# Altium project RFID_CC1101_433MHz.PrjPcb
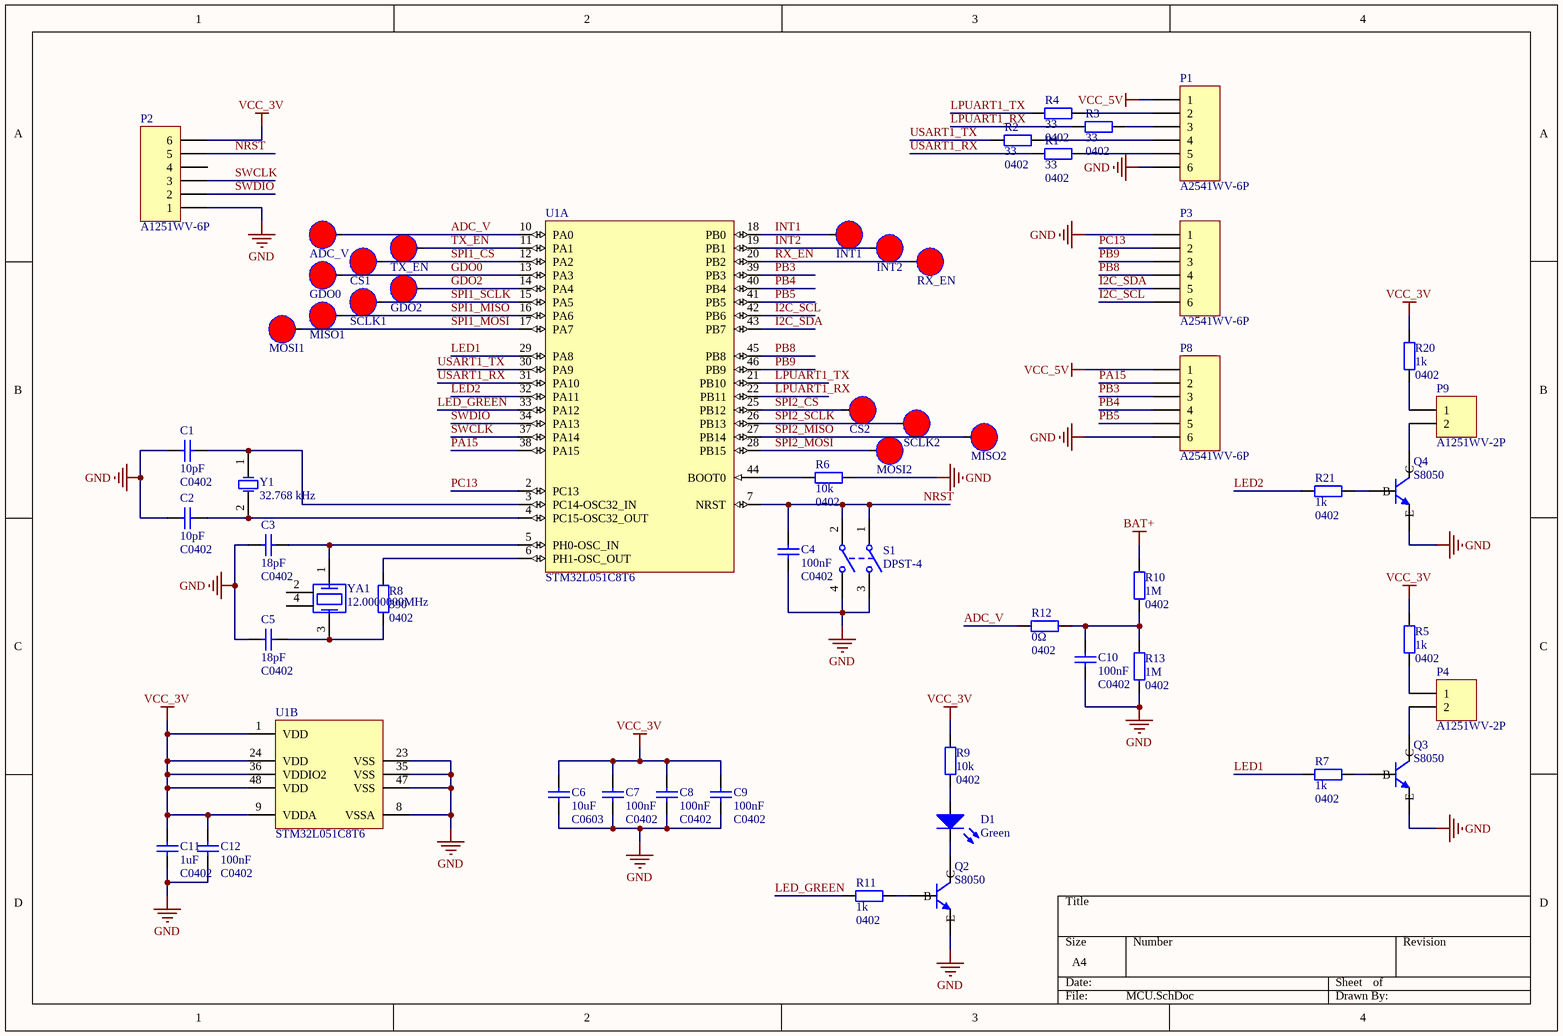
[diagram p0: MCU.SchDoc]
3 sheets, 104 parts. Net scope: global (net labels, ports and power ports of the same name join across sheets).
Board file: RFID_CC1101_433MHz.PcbDoc
Sheets:
  MCU.SchDoc
  MEMS&RF.SchDoc
  Power.SchDoc

## Sheet MCU.SchDoc
size A4

### Parts
(Parts that share a designator on the sheet are numbered #1, #2 ... from top to bottom, then left to right.)
ADC_V  TP-EMB-SMT-Single-20mil-1pin  [EMB-SMT-40MILX40MIL]  (value not drawn)
C1#1  10pF  PackageReference: C0402  [0402]
C2#1  10pF  PackageReference: C0402  [0402]
C3#1  18pF  PackageReference: C0402  [0402]
C4#1  100nF  PackageReference: C0402  [0402]
C5#1  18pF  PackageReference: C0402  [0402]
C6#1  10uF  PackageReference: C0603  [1608[0603]]
C7#1  100nF  PackageReference: C0402  [0402]
C8  100nF  PackageReference: C0402  [0402]
C9  100nF  PackageReference: C0402  [0402]
C10  100nF  PackageReference: C0402  [0402]
C11  1uF  PackageReference: C0402  [0402]
C12  100nF  PackageReference: C0402  [0402]
CS1  TP-EMB-SMT-Single-20mil-1pin  [EMB-SMT-40MILX40MIL]  (value not drawn)
CS2  TP-EMB-SMT-Single-20mil-1pin  [EMB-SMT-40MILX40MIL]  (value not drawn)
D1#1  Green  [0603/K]
GDO0  TP-EMB-SMT-Single-20mil-1pin  [EMB-SMT-40MILX40MIL]  (value not drawn)
GDO2  TP-EMB-SMT-Single-20mil-1pin  [EMB-SMT-40MILX40MIL]  (value not drawn)
INT1  TP-EMB-SMT-Single-20mil-1pin  [EMB-SMT-40MILX40MIL]  (value not drawn)
INT2  TP-EMB-SMT-Single-20mil-1pin  [EMB-SMT-40MILX40MIL]  (value not drawn)
MISO1  TP-EMB-SMT-Single-20mil-1pin  [EMB-SMT-40MILX40MIL]  (value not drawn)
MISO2  TP-EMB-SMT-Single-20mil-1pin  [EMB-SMT-40MILX40MIL]  (value not drawn)
MOSI1  TP-EMB-SMT-Single-20mil-1pin  [EMB-SMT-40MILX40MIL]  (value not drawn)
MOSI2  TP-EMB-SMT-Single-20mil-1pin  [EMB-SMT-40MILX40MIL]  (value not drawn)
P1  A2541WV-6P  [A2541WV-6P]
P2#1  A1251WV-6P  [A1251WV-6P-SWD]
P3#1  A2541WV-6P  [A2541WV-6P]
P4#1  A1251WV-2P  [A1251WV-2P]
P8  A2541WV-6P  [A2541WV-6P]
P9  A1251WV-2P  [A1251WV-2P]
Q2  S8050  [SOT-23B_N]
Q3  S8050  [SOT-23B_N]
Q4  S8050  [SOT-23B_N]
R1#1  33  PackageReference: 0402  [RESC1005X04N]
R2#1  33  PackageReference: 0402  [RESC1005X04N]
R3#1  33  PackageReference: 0402  [RESC1005X04N]
R4#1  33  PackageReference: 0402  [RESC1005X04N]
R5  1k  PackageReference: 0402  [RESC1005X04N]
R6  10k  PackageReference: 0402  [RESC1005X04N]
R7  1k  PackageReference: 0402  [RESC1005X04N]
R8  390  PackageReference: 0402  [RESC1005X04N]
R9  10k  PackageReference: 0402  [RESC1005X04N]
R10  1M  PackageReference: 0402  [RESC1005X04N]
R11  1k  PackageReference: 0402  [RESC1005X04N]
R12  0Ω  PackageReference: 0402  [RESC1005X04N]
R13  1M  PackageReference: 0402  [RESC1005X04N]
R20  1k  PackageReference: 0402  [RESC1005X04N]
R21  1k  PackageReference: 0402  [RESC1005X04N]
RX_EN  TP-EMB-SMT-Single-20mil-1pin  [EMB-SMT-40MILX40MIL]  (value not drawn)
S1  DPST-4  [DPST]
SCLK1  TP-EMB-SMT-Single-20mil-1pin  [EMB-SMT-40MILX40MIL]  (value not drawn)
SCLK2  TP-EMB-SMT-Single-20mil-1pin  [EMB-SMT-40MILX40MIL]  (value not drawn)
TX_EN  TP-EMB-SMT-Single-20mil-1pin  [EMB-SMT-40MILX40MIL]  (value not drawn)
U1  STM32L051C8T6  [STM-LQFP48_N]  (parts A,B of 2)
Y1  32.768 kHz  [XTAL-2012]
YA1#1  12.0000000MHz  [XTAL-SMT-4P]

### Nets
BAT+: R10.2
GND: C1#1.1 C2#1.1 C3#1.1 C4#1.1 C5#1.1 C6#1.1 C7#1.1 C8.1 C9.1 C10.1 C11.1 C12.1 P1.6 P2#1.1 P3#1.1 P8.6 Q2.E Q3.E Q4.E R6.2 R13.1 S1.3(NO1) S1.4(NO2) U1.8(VSSA) U1.23(VSS) U1.35(VSS) U1.47(VSS)
VCC_3V: C6#1.2 C7#1.2 C8.2 C9.2 C11.2 C12.2 P2#1.6 R5.2 R9.2 R20.2 U1.1(VDD) U1.9(VDDA) U1.24(VDD) U1.36(VDDIO2) U1.48(VDD)
VCC_5V: P1.1 P8.1
ADC_V: ADC_V.1 R12.1 U1.10(PA0)
GDO0: GDO0.1 U1.13(PA3)
GDO2: GDO2.1 U1.14(PA4)
I2C_SCL: P3#1.6 U1.42(PB6)
I2C_SDA: P3#1.5 U1.43(PB7)
INT1: INT1.1 U1.18(PB0)
INT2: INT2.1 U1.19(PB1)
LED1: R7.1 U1.29(PA8)
LED2: R21.1 U1.32(PA11)
LED_GREEN: R11.1 U1.33(PA12)
LPUART1_RX: R3#1.1 U1.22(PB11)
LPUART1_TX: R4#1.1 U1.21(PB10)
NRST: C4#1.2 P2#1.5 S1.1(COMMON1) S1.2(COMMON2) U1.7(NRST)
PA15: P8.2 U1.38(PA15)
PB3: P8.3 U1.39(PB3)
PB4: P8.4 U1.40(PB4)
PB5: P8.5 U1.41(PB5)
PB8: P3#1.4 U1.45(PB8)
PB9: P3#1.3 U1.46(PB9)
PC13: P3#1.2 U1.2(PC13)
RX_EN: RX_EN.1 U1.20(PB2)
SPI1_CS: CS1.1 U1.12(PA2)
SPI1_MISO: MISO1.1 U1.16(PA6)
SPI1_MOSI: MOSI1.1 U1.17(PA7)
SPI1_SCLK: SCLK1.1 U1.15(PA5)
SPI2_CS: CS2.1 U1.25(PB12)
SPI2_MISO: MISO2.1 U1.27(PB14)
SPI2_MOSI: MOSI2.1 U1.28(PB15)
SPI2_SCLK: SCLK2.1 U1.26(PB13)
SWCLK: P2#1.3 U1.37(PA14)
SWDIO: P2#1.2 U1.34(PA13)
TX_EN: TX_EN.1 U1.11(PA1)
USART1_RX: R1#1.1 U1.31(PA10)
USART1_TX: R2#1.2 U1.30(PA9)
NetC1#1_2: C1#1.2 U1.3(PC14-OSC32_IN) Y1.1(OSC1)
NetC2#1_2: C2#1.2 U1.4(PC15-OSC32_OUT) Y1.2(OSC2)
NetC3#1_2: C3#1.2 U1.5(PH0-OSC_IN) YA1#1.1
NetC5#1_2: C5#1.2 R8.1 YA1#1.3
NetC10_2: C10.2 R10.1 R12.2 R13.2
NetD1#1_A: D1#1.A R9.1
NetD1#1_K: D1#1.K Q2.C
NetP1_2: P1.2 R4#1.2
NetP1_3: P1.3 R3#1.2
NetP1_4: P1.4 R2#1.1
NetP1_5: P1.5 R1#1.2
NetP4#1_1: P4#1.1 R5.1
NetP4#1_2: P4#1.2 Q3.C
NetP9_1: P9.1 R20.1
NetP9_2: P9.2 Q4.C
NetQ2_B: Q2.B R11.2
NetQ3_B: Q3.B R7.2
NetQ4_B: Q4.B R21.2
NetR6_1: R6.1 U1.44(BOOT0)
NetR8_2: R8.2 U1.6(PH1-OSC_OUT)

Not connected (* = marked no-connect by the designer): P2#1 4; YA1#1 2 4

### Library data of the parts
ADC_V CS1 CS2 GDO0 GDO2 INT1 INT2 MISO1 MISO2 MOSI1 MOSI2 RX_EN SCLK1 SCLK2 TX_EN = TP-EMB-SMT-Single-20mil-1pin: Test Point Designed for holding a standard probe lead
C1#1 C2#1 = CC0402FRNPO9BN100: Capacitor (0402,NPO,10pF,DC 50V,±1%) YAGEO; Published: 8-Jun-2000; LatestRevisionDate: 29-May-2009; LatestRevisionNote: IPC-7351 Footprint Added.; Publisher: Altium Limited; PackageDescription: Chip Capacitor; Value: 10pF
C3#1 C5#1 = CC0402FRNPO9BN180: Capacitor (0402,NPO,18pF,DC 50V,±1%) YAGEO; Published: 8-Jun-2000; LatestRevisionDate: 29-May-2009; LatestRevisionNote: IPC-7351 Footprint Added.; Publisher: Altium Limited; PackageDescription: Chip Capacitor; Value: 18pF
C4#1 C7#1 C8-C10 C12 = GRM155R71H104KE14: Capacitor (0402,X7R,100nF,DC 50V,±10%) Murata; Published: 8-Jun-2000; LatestRevisionDate: 29-May-2009; LatestRevisionNote: IPC-7351 Footprint Added.; Publisher: Altium Limited; PackageDescription: Chip Capacitor; Value: 100nF
C6#1 = GRM188R61E106MA73: Capacitor(0603,X5R(EIA),10uF,DC 25V,+/-20 %) muRata; Published: 8-Jun-2000; LatestRevisionDate: 29-May-2009; LatestRevisionNote: IPC-7351 Footprint Added.; Publisher: Altium Limited; PackageDescription: Chip Capacitor; Value: 10uF
C11 = GRM155R61E105KE11: Capacitor (0402,X5R,1uF,DC 25V,±10%) Murata; Published: 8-Jun-2000; LatestRevisionDate: 29-May-2009; LatestRevisionNote: IPC-7351 Footprint Added.; Publisher: Altium Limited; PackageDescription: Chip Capacitor; Value: 1uF
D1#1 = XL-1608SYGC: Standard 0603 SMD LED, Green, 1.6-2.2V; Published: 8-Jun-2000; LatestRevisionDate: 17-Jul-2002; LatestRevisionNote: Re-released for DXP Platform.; PackageVersion: Feb-2002; PackageReference: 0603; Publisher: Altium Limited; PackageDescription: SM LED; 2 Flat Leads; Valid: Green
P1 P3#1 P8 = A2541WV-6P: Header, 6-Pin, 针座-2.54mm间距，180度，DIP排针; LatestRevisionDate: 17-Jul-2002; LatestRevisionNote: Re-released for DXP Platform.; Publisher: Altium Limited
P2#1 = A1251WV-6P: Header, 6-Pin, 1.25mm PITCH, 180° WAFER; LatestRevisionDate: 17-Jul-2002; LatestRevisionNote: Re-released for DXP Platform.; Publisher: Altium Limited
P4#1 P9 = A1251WV-2P: Header, 2-Pin, 1.25mm PITCH, 180° WAFER; LatestRevisionDate: 17-Jul-2002; LatestRevisionNote: Re-released for DXP Platform.; Publisher: Altium Limited
Q2-Q4 = S8050: NPN General Purpose Amplifier, -55 to +150°C; Manufacturer: 扬州扬杰电子科技股份有限公司; VCBO(V): 40; VCEO(V): 25; VEBO(V): 5; IC(mA): 500; PC(mW): 300; Package: SOT-23
R1#1 R2#1 R3#1 R4#1 = RC0402FR-0733RL: Resistor 0402(1005) 33Ω ±1%; PackageDescription: Chip Resistor, 2-Leads, Body 1.00x0.50mm, IPC Medium Density; Value: 33
R5 R7 R11 R20 R21 = RC0402FR-071KL: Resistor 0402(1005) 1kΩ ±1%; PackageDescription: Chip Resistor, 2-Leads, Body 1.00x0.50mm, IPC Medium Density; Value: 1k
R6 R9 = RC0402FR-0710KL: Resistor 0402(1005) 10kΩ ±1%; PackageDescription: Chip Resistor, 2-Leads, Body 1.00x0.50mm, IPC Medium Density; Value: 10k
R8 = RC0402FR-07390RL: Resistor 0402(1005) 390Ω ±1%; PackageDescription: Chip Resistor, 2-Leads, Body 1.00x0.50mm, IPC Medium Density; Value: 390
R10 R13 = RC0402FR-071ML: Resistor 0402(1005) 1MΩ ±1%; PackageDescription: Chip Resistor, 2-Leads, Body 1.00x0.50mm, IPC Medium Density; Value: 1M
R12 = RC0402JR: Resistor 0402(1005) 0Ω; PackageDescription: Chip Resistor, 2-Leads, Body 1.00x0.50mm, IPC Medium Density; Value: 0Ω
S1 = CX-G001: 5.2*5.2轻触开关; Published: 24-Mar-1999; LatestRevisionDate: 17-Jul-2002; LatestRevisionNote: Re-released for DXP Platform.; PackageReference: DPST-4; Publisher: Altium Limited; PackageDescription: Switch; 4 Leads
U1 = STM32L051C8T6: Access line ultra-low-power 32-bit MCU Arm®-based Cortex®-M0+, 64 KB Flash, 8 KB SRAM,2 KB EEPROM, 38 fast I/Os, 48-pin LQFP, -40 to 125 degC, Tray; A/D Converter: 2x12-bit; Core: ARM Cortex-M0+; FLASH Size (Prog) (kB): 64; I/Os (High Current): 37; Internal RAM Size (kB): 20; Operating Frequency(F) (Processor speed) (MHz): 32; Supply Voltage(Vcc) min (V): 2; DatasheetVersion: Rev. 16; PackageVersion: Rev. 6, 06/2013; PackageReference: LQFP48; PackageDescription: 48-Pin Low Profile Quad Flat Package, 7 x 7 mm Body, 0.5 mm Pitch; Supplier 1: Digi-Key; Supplier Part Number 1: 497-11517-ND; Supplier 2: Farnell; Supplier Part Number 2: 1899017; Supplier 3: Newark; Supplier Part Number 3: 72T2644; Supplier 4: Mouser; Supplier Part Number 4: 511-STM32L051C8T6; Packing: Tray; Mounting Technology: Surface Mount; PartNumber: STM32L051C8T6; ComponentLink1Description: Manufacturer URL; ComponentLink1URL: http://www.st.com/web/en/home.html; ComponentLink2Description: Datasheet; ComponentLink2URL: http://www.st.com/st-web-ui/static/active/en/resource/technical/document/datasheet/CD00161566.pdf; ComponentLink3Description: Package Specification; ComponentLink3URL: http://www.st.com/st-web-ui/static/active/en/resource/technical/document/datasheet/DM00058181.pdf
Y1 = 7RC32768F12UC: Crystal Oscillator, 2.0×1.2×0.6 mm, 2 Pins, 32.768kHz, -40°C~+85°C, 12pF; Manufacturer: SJK; Package size (L×W×H): 2.0×1.2×0.60 mm; Frequency Tolerance: ±5ppm, ±10ppm, ±20ppm (max.) at 25°C; Frequency range: 32.768 kHz; Operating Temperature Range: Re-released for DXP Platform.; PackageReference: -40°C~+85°C; Load Capacitance: 12pF
YA1#1 = 7U12000E12UCG: Crystal Oscillator, 3.2×2.5×0.70 mm, 4 Pins, 12.000MHz, -40°C~+85°C, 12pF, ±10PPM; Manufacturer: SJK; Mode: AT/Fundamental; Frequency Tolerance: ±10ppm max; Load Capacitance(CL): 12.0pF; Shunt Capacitance: 3.0 pF Max; Frequency Range: 12.0000000MHz; Operating Temperature Range: -40 °C to +85°C; Package size (L×W×H): 3.2×2.5×0.70 mm

## Sheet MEMS&RF.SchDoc
size A4
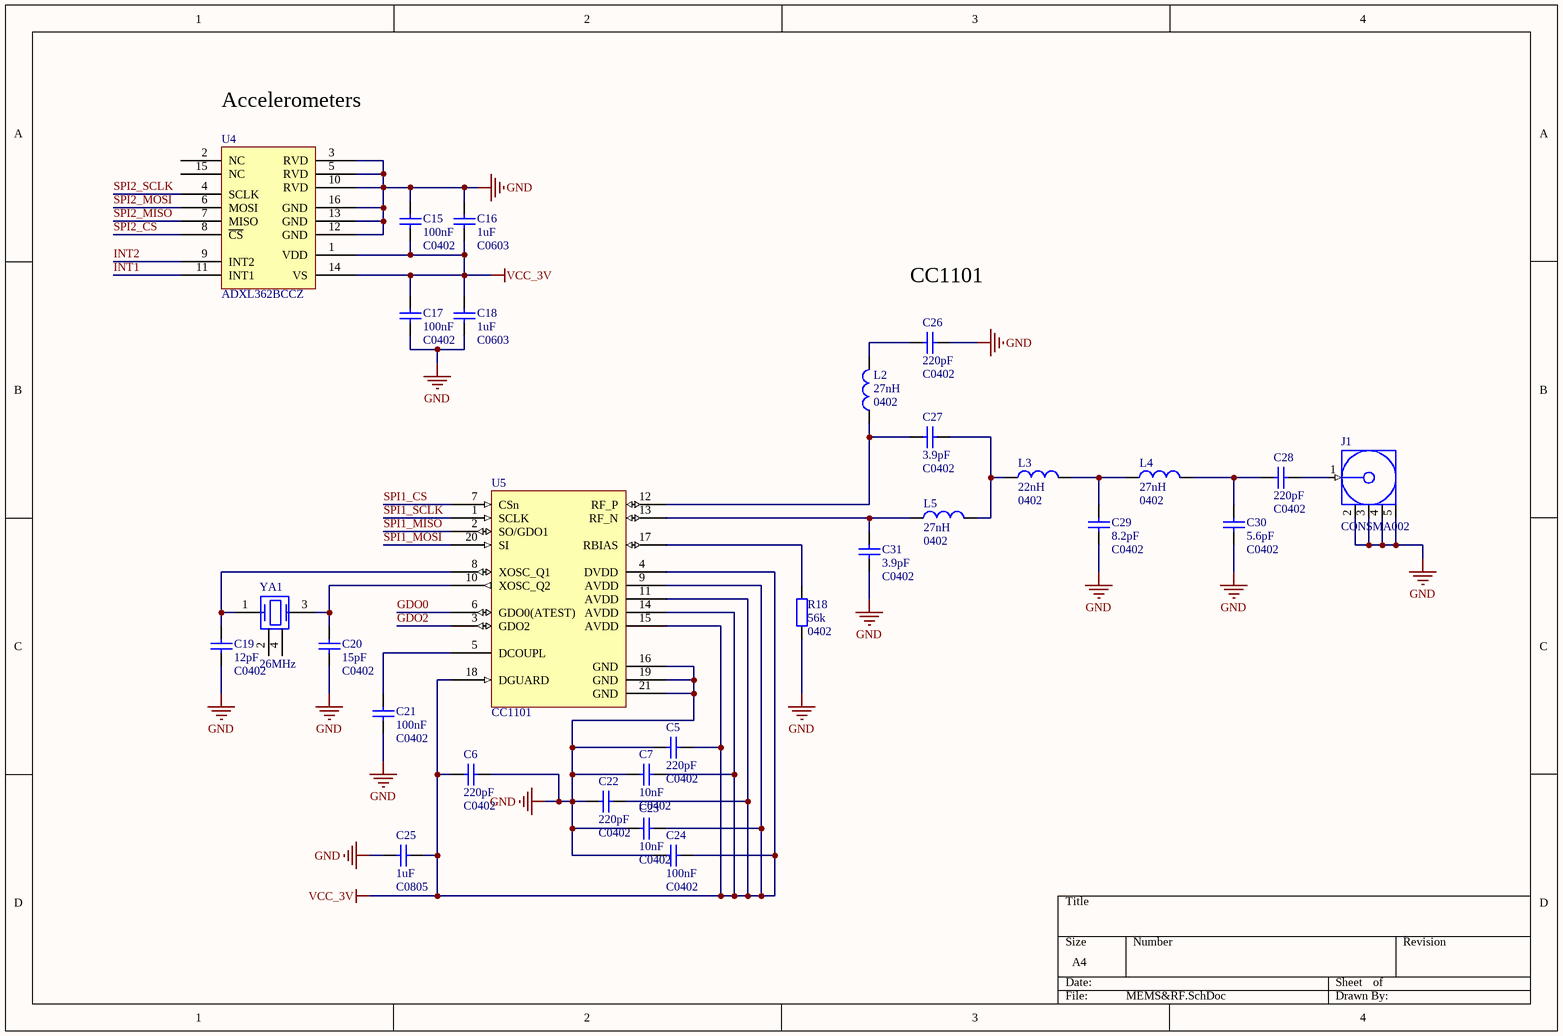
[diagram p1: MEMS&RF.SchDoc]

### Parts
(Parts that share a designator on the sheet are numbered #1, #2 ... from top to bottom, then left to right.)
C5#2  220pF  PackageReference: C0402  [0402]
C6#2  220pF  PackageReference: C0402  [0402]
C7#2  10nF  PackageReference: C0402  [0402]
C15  100nF  PackageReference: C0402  [0402]
C16  1uF  PackageReference: C0603  [1608[0603]]
C17  100nF  PackageReference: C0402  [0402]
C18  1uF  PackageReference: C0603  [1608[0603]]
C19  12pF  PackageReference: C0402  [0402]
C20  15pF  PackageReference: C0402  [0402]
C21  100nF  PackageReference: C0402  [0402]
C22  220pF  PackageReference: C0402  [0402]
C23  10nF  PackageReference: C0402  [0402]
C24  100nF  PackageReference: C0402  [0402]
C25  1uF  [C0805]
C26  220pF  PackageReference: C0402  [0402]
C27  3.9pF  PackageReference: C0402  [0402]
C28  220pF  PackageReference: C0402  [0402]
C29  8.2pF  PackageReference: C0402  [0402]
C30  5.6pF  PackageReference: C0402  [0402]
C31  3.9pF  PackageReference: C0402  [0402]
J1  CONSMA002  [CON-SMA-RA]
L2  27nH  [0402]
L3  22nH  [0402]
L4  27nH  [0402]
L5  27nH  [0402]
R18  56k  PackageReference: 0402  [RESC1005X04N]
U4  ADXL362BCCZ  [LGA_CC-16-4]
U5  CC1101  [QFN50P400X400X100_HS-21N]
YA1#2  26MHz  [XTAL-SMT-4P]

### Nets
GND: C5#2.2 C6#2.1 C7#2.1 C15.1 C16.2 C17.2 C18.1 C19.1 C20.1 C21.1 C22.2 C23.1 C24.2 C25.1 C26.2 C29.1 C30.1 C31.1 J1.2(GND) J1.3(GND) J1.4(GND) J1.5(GND) R18.1 U4.3(RVD) U4.5(RVD) U4.10(RVD) U4.12(GND) U4.13(GND) U4.16(GND) U5.16(GND) U5.19(GND) U5.21(GND)
VCC_3V: C5#2.1 C6#2.2 C7#2.2 C15.2 C16.1 C17.1 C18.2 C22.1 C23.2 C24.1 C25.2 U4.1(VDD) U4.14(VS) U5.4(DVDD) U5.9(AVDD) U5.11(AVDD) U5.14(AVDD) U5.15(AVDD) U5.18(DGUARD)
GDO0: U5.6(GDO0(ATEST))
GDO2: U5.3(GDO2)
INT1: U4.11(INT1)
INT2: U4.9(INT2)
SPI1_CS: U5.7(CSn)
SPI1_MISO: U5.2(SO/GDO1)
SPI1_MOSI: U5.20(SI)
SPI1_SCLK: U5.1(SCLK)
SPI2_CS: U4.8(~{CS})
SPI2_MISO: U4.7(MISO)
SPI2_MOSI: U4.6(MOSI)
SPI2_SCLK: U4.4(SCLK)
NetC19_2: C19.2 U5.8(XOSC_Q1) YA1#2.1
NetC20_2: C20.2 U5.10(XOSC_Q2) YA1#2.3
NetC21_2: C21.2 U5.5(DCOUPL)
NetC26_1: C26.1 L2.2
NetC27_1: C27.1 L2.1 U5.12(RF_P)
NetC27_2: C27.2 L3.1 L5.2
NetC28_1: C28.1 C30.2 L4.2
NetC28_2: C28.2 J1.1(Signal)
NetC29_2: C29.2 L3.2 L4.1
NetC31_2: C31.2 L5.1 U5.13(RF_N)
NetR18_2: R18.2 U5.17(RBIAS)

Not connected (* = marked no-connect by the designer): U4 2(NC) 15(NC); YA1#2 2 4

### Notes on the sheet
- (near U4) Accelerometers
- CC1101

### Library data of the parts
C5#2 C6#2 C22 C26 C28 = GRM1555C1H221JA01D: Capacitor (0402,NP0,220pF,DC 50V,±5%) Murata; Published: 8-Jun-2000; LatestRevisionDate: 29-May-2009; LatestRevisionNote: IPC-7351 Footprint Added.; Publisher: Altium Limited; PackageDescription: Chip Capacitor; Value: 220pF
C7#2 C23 = GRM155R71E103KA01D: Capacitor (0402,X7R,10nF,DC 25V,±10%) Murata; Published: 8-Jun-2000; LatestRevisionDate: 29-May-2009; LatestRevisionNote: IPC-7351 Footprint Added.; Publisher: Altium Limited; PackageDescription: Chip Capacitor; Value: 10nF
C15 C17 = C1005X7R1H104K050BE: Capacitor (0402,X7R,100nF,DC 50V,±10%) TDK; Published: 8-Jun-2000; LatestRevisionDate: 29-May-2009; LatestRevisionNote: IPC-7351 Footprint Added.; Publisher: Altium Limited; PackageDescription: Chip Capacitor; Value: 100nF
C16 C18 = CGA3E2X5R1A105K080AA: Capacitor (0603,X5R,1uF,DC 10V,+/-10%) TDK; Published: 8-Jun-2000; LatestRevisionDate: 29-May-2009; LatestRevisionNote: IPC-7351 Footprint Added.; Publisher: Altium Limited; PackageDescription: Chip Capacitor; Value: 1uF
C19 = GRM1555C1H120JZ01D: Capacitor (0402,NP0,12pF,DC 50V,±5%) Murata; Published: 8-Jun-2000; LatestRevisionDate: 29-May-2009; LatestRevisionNote: IPC-7351 Footprint Added.; Publisher: Altium Limited; PackageDescription: Chip Capacitor; Value: 12pF
C20 = GRM1555C1H150JZ01D: Capacitor (0402,NP0,15pF,DC 50V,±5%) Murata; Published: 8-Jun-2000; LatestRevisionDate: 29-May-2009; LatestRevisionNote: IPC-7351 Footprint Added.; Publisher: Altium Limited; PackageDescription: Chip Capacitor; Value: 15pF
C21 C24 = GRM155R71A104KA01D: Capacitor (0402,X5R,100nF,DC 10V,±10%) Murata; Published: 8-Jun-2000; LatestRevisionDate: 29-May-2009; LatestRevisionNote: IPC-7351 Footprint Added.; Publisher: Altium Limited; PackageDescription: Chip Capacitor; Value: 100nF
C25 = GRM21BR71C105KA01L: Capacitor (0805,X7R,1uF,DC 16V,±10%) Murata; Published: 8-Jun-2000; LatestRevisionDate: 29-May-2009; LatestRevisionNote: IPC-7351 Footprint Added.; Publisher: Altium Limited; PackageDescription: Chip Capacitor; Value: 1uF; PackageReference: C0805
C27 C31 = GRM1555C1H3R9CZ01D: Capacitor (0402,NP0,3.9pF,DC 50V,±0.25pF) Murata; Published: 8-Jun-2000; LatestRevisionDate: 29-May-2009; LatestRevisionNote: IPC-7351 Footprint Added.; Publisher: Altium Limited; PackageDescription: Chip Capacitor; Value: 3.9pF
C29 = GRM1555C1H8R2CZ01D: Capacitor (0402,NP0,8.2pF,DC 50V,±0.25pF) Murata; Published: 8-Jun-2000; LatestRevisionDate: 29-May-2009; LatestRevisionNote: IPC-7351 Footprint Added.; Publisher: Altium Limited; PackageDescription: Chip Capacitor; Value: 8.2pF
C30 = GRM1555C1H5R6CZ01D: Capacitor (0402,NP0,5.6pF,DC 50V,±0.25pF) Murata; Published: 8-Jun-2000; LatestRevisionDate: 29-May-2009; LatestRevisionNote: IPC-7351 Footprint Added.; Publisher: Altium Limited; PackageDescription: Chip Capacitor; Value: 5.6pF
J1 = CONSMA002: SMA Female Right Angle PCB Mount Connector; DatasheetVersion: rev1.2, Aug-2008; PackageVersion: rev1.2, Aug-2008; PackageReference: CON-SMA-RA; PackageDescription: SMA Female Right Angle, PCB Mount Connector, Thru-Hole, 7 x 7 mm Body; ComponentLink1Description: Manufacturer URL; ComponentLink1URL: http://www.linxtechnologies.com/; ComponentLink2Description: Datasheet; ComponentLink2URL: http://www.connectorcity.com/diagrams/SMA/CONSMA002.pdf
L2 L4 L5 = LQG15HS27NJ02D: Inductor, 27n, 0402, ±5% / Murata; Published: 8-Jun-2000; LatestRevisionDate: 29-May-2009; LatestRevisionNote: IPC-7351 Footprint Added.; Publisher: Altium Limited; PackageDescription: Inductor; Value: 27nH; PackageReference: 0402
L3 = LQG15HS22NJ02D: Inductor, 22n, 0402, ±5% / Murata; Published: 8-Jun-2000; LatestRevisionDate: 29-May-2009; LatestRevisionNote: IPC-7351 Footprint Added.; Publisher: Altium Limited; PackageDescription: Inductor; Value: 22nH; PackageReference: 0402
R18 = RK73H1ETTP5602F: Resistor, 56k ohms, 0402, ±1% Koa; PackageDescription: Chip Resistor, 2-Leads, Body 1.00x0.50mm, IPC Medium Density; Value: 56k
U4 = ADXL362BCCZ: ADXL362, LGA, CC-16-4.
U5 = CC1101: Low-Power Sub-1GHz RF Transceiver
YA1#2 = NX3225GA-26M: Crystal, 26.000000MHz, 10.0pF, 50 ohms max, 20/40 ppm, -40C to +85C / , NDK; Valid: 26MHz

## Sheet Power.SchDoc
size A4
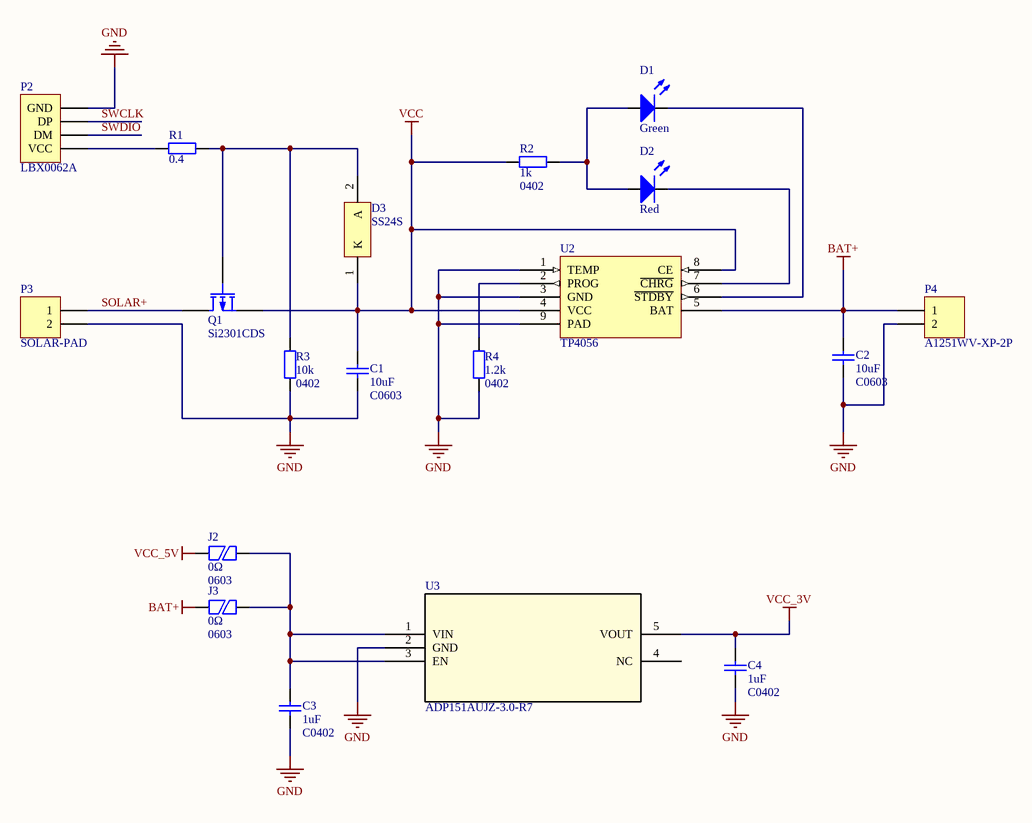
[diagram p2: Power.SchDoc]

### Parts
(Parts that share a designator on the sheet are numbered #1, #2 ... from top to bottom, then left to right.)
C1#2  10uF  PackageReference: C0603  [1608[0603]]
C2#2  10uF  PackageReference: C0603  [1608[0603]]
C3#2  1uF  PackageReference: C0402  [0402]
C4#2  1uF  PackageReference: C0402  [0402]
D1#2  Green  [0603/K]
D2  Red  [0603/K]
D3  SS24S  [ONSC-SMA-2-403D-02_V]
J2  0Ω  PackageReference: 0603  [1608[0603] - jumper]
J3  0Ω  PackageReference: 0603  [1608[0603] - jumper]
P2#2  LBX0062A  [LBX0062A]
P3#2  SOLAR-PAD  [SOLAR-PAD]
P4#2  A1251WV-XP-2P  [A1251WV-XP-2P]
Q1  Si2301CDS  [SOT95P237X112-3N]
R1#2  0.4  [RESC3216X07N]
R2#2  1k  PackageReference: 0402  [RESC1005X04N]
R3#2  10k  PackageReference: 0402  [RESC1005X04N]
R4#2  1.2k  PackageReference: 0402  [RESC1005X04N]
U2  TP4056  [ESOP-9N]
U3  ADP151AUJZ-3.0-R7  [UJ_5]

### Nets
BAT+: C2#2.2 J3.1 P4#2.1 U2.5(BAT)
GND: C1#2.1 C2#2.1 C3#2.1 C4#2.1 P2#2.4(GND) P3#2.2 P4#2.2 R3#2.1 R4#2.1 U2.1(TEMP) U2.3(GND) U2.9(PAD) U3.2(GND)
VCC: C1#2.2 D3.1(K) Q1.2(S) R2#2.1 U2.4(VCC) U2.8(CE)
VCC_3V: C4#2.2 U3.5(VOUT)
VCC_5V: J2.1
SOLAR+: P3#2.1 Q1.3(D)
SWCLK: P2#2.3(DP)
SWDIO: P2#2.2(DM)
NetC3#2_2: C3#2.2 J2.2 J3.2 U3.1(VIN) U3.3(EN)
NetD1#2_A: D1#2.A D2.A R2#2.2
NetD1#2_K: D1#2.K U2.6(~{STDBY})
NetD2_K: D2.K U2.7(~{CHRG})
NetD3_2: D3.2(A) Q1.1(G) R1#2.2 R3#2.2
NetP2#2_1: P2#2.1(VCC) R1#2.1
NetR4#2_2: R4#2.2 U2.2(PROG)

Not connected (* = marked no-connect by the designer): U3 4(NC)

### Library data of the parts
C1#2 C2#2 = C1608X5R1A106K080AC: Capacitor (0603,X5R,10uF,DC 10V,±10%) TDK; Published: 8-Jun-2000; LatestRevisionDate: 29-May-2009; LatestRevisionNote: IPC-7351 Footprint Added.; Publisher: Altium Limited; PackageDescription: Chip Capacitor; Value: 10uF
C3#2 C4#2 = C1005X5R1E105K050BC: Capacitor (0402,X5R,1uF,DC 25V,±10%) TDK; Published: 8-Jun-2000; LatestRevisionDate: 29-May-2009; LatestRevisionNote: IPC-7351 Footprint Added.; Publisher: Altium Limited; PackageDescription: Chip Capacitor; Value: 1uF
D1#2 = TLMG1100-GS08: Standard 0603 SMD LED, Green, 2.1V,-40 °C to +100 °C; Published: 8-Jun-2000; LatestRevisionDate: 17-Jul-2002; LatestRevisionNote: Re-released for DXP Platform.; PackageVersion: Feb-2002; PackageReference: 0603; Publisher: Altium Limited; PackageDescription: SM LED; 2 Flat Leads; Valid: Green
D2 = TLMS1100-GS08: Standard 0603 SMD LED, Red, 2.1V,-40 °C to +100 °C; Published: 8-Jun-2000; LatestRevisionDate: 17-Jul-2002; LatestRevisionNote: Re-released for DXP Platform.; PackageVersion: Feb-2002; PackageReference: 0603; Publisher: Altium Limited; PackageDescription: SM LED; 2 Flat Leads; Valid: Red
D3 = SS24S: Schottky Power Rectifier, 2-Pin SMA, VRRM=40V , VF=0.517V at IF=2.0A , Pb-Free, Tape and Reel; Manufacturer: On Semiconductor; Configuration: Single; IFSM Max (A): 40; DatasheetVersion: Rev. 7; PackageVersion: Rev. G, 07/2012; PackageReference: SMA-2-403D-02; PackageDescription: 2-Pin Small Molded Package, J-Bend Lead, Body 2.605 x 4.315 mm; Supplier 1: Digi-Key; Supplier Part Number 1: SS16T3GOSTR-ND; Supplier 2: Digi-Key; Supplier Part Number 2: SS16T3GOSCT-ND; Supplier 3: Digi-Key; Supplier Part Number 3: SS16T3GOSDKR-ND; Supplier 4: Farnell; Supplier Part Number 4: 2317421; Supplier 5: Farnell; Supplier Part Number 5: 1900107; Supplier 6: Newark; Supplier Part Number 6: 98H0976; Supplier 7: Newark; Supplier Part Number 7: 10N9613; Supplier 8: Mouser; Supplier Part Number 8: 863-SS16T3G; Packing: Tape and Reel; RoHS: TRUE; Mounting Technology: Surface Mount; PartNumber: SS24S; ComponentLink1Description: Manufacturer URL; ComponentLink1URL: http://www.onsemi.com/; ComponentLink2Description: Datasheet; ComponentLink2URL: http://www.onsemi.cn/pub_link/Collateral/SS16-D.PDF; ComponentLink3Description: Package Specification; ComponentLink3URL: http://www.onsemi.com/pub_link/Collateral/403D-02.PDF
J2 J3 = JUMP-0603: jumper 0603(1608); PackageDescription: Chip Resistor, 2-Leads, Body 1.60x0.80mm, IPC Medium Density; Value: 0Ω
P2#2 = LBX0062A: PogoPinLBX0062A, 4-Pin; LatestRevisionDate: 17-Jul-2002; LatestRevisionNote: Re-released for DXP Platform.; Publisher: Altium Limited
P3#2 = SOLAR-PAD: Header, 2-Pin; LatestRevisionDate: 17-Jul-2002; LatestRevisionNote: Re-released for DXP Platform.; Publisher: Altium Limited
P4#2 = A1251WV-XP-2P: Header, 2-Pin; LatestRevisionDate: 17-Jul-2002; LatestRevisionNote: Re-released for DXP Platform.; Publisher: Altium Limited
Q1 = Si2301CDS: P-Channel MOSFET,VDS=-20V,VGS=8V,ID=3.1A,VGS(th)Min=0.4V,SOT-23; Published: 8-Jun-2000; LatestRevisionDate: 17-Jul-2002; LatestRevisionNote: Re-released for DXP Platform.; PackageVersion: 1995/1996; PackageReference: SOT23; Publisher: Altium Limited; PackageDescription: SOT23, 3-Leads, Body 2.92x2.37mm, Pitch 0.95mm, IPC Medium Density
R1#2 = PE1206FRF470R4L: Resistor 1206(3216) 0.4Ω ±1% 1W AUTOMOTIVE GRADEPE_L series; PackageReference: 1206; PackageDescription: Chip Resistor, 2-Leads, Body 3.20x1.60mm, IPC Medium Density; Value: 0.4
R2#2 = RC0402FR-071KL: Resistor 0402(1005) 1kΩ ±1%; PackageDescription: Chip Resistor, 2-Leads, Body 1.00x0.50mm, IPC Medium Density; Value: 1k
R3#2 = RC0402FR-0710KL: Resistor 0402(1005) 10kΩ ±1%; PackageDescription: Chip Resistor, 2-Leads, Body 1.00x0.50mm, IPC Medium Density; Value: 10k
R4#2 = RC0402FR-071K2L: Resistor 0402(1005) 1.2kΩ ±1%; PackageDescription: Chip Resistor, 2-Leads, Body 1.00x0.50mm, IPC Medium Density; Value: 1.2k
U2 = TP4056: 1A线性锂离子电池充电器
U3 = ADP151: The ADP151 is an ultralow noise, low dropout (LDO) linear regulator that operates from 2.2 V to 5.5 V and provides up to 200 mA of output current.; Dropout Voltage(mV): 140; RMS Niose(uV): 9; Isupply(uA): 10; Vin(V): 2.2-5.5; Iout(max)(mA): 200; Vout(V): 1.1, 1.2, 1.5, 1.8, 2.1, 2.5, 2.6, 2.75, 2.8, 2.85, 3.0, 3.3

## Nets that join several sheets
BAT+: MCU (R10.2), Power (C2#2.2 J3.1 P4#2.1 U2.5)
GND: MCU (27 pins), MEMS&RF (32 pins), Power (13 pins)
VCC_3V: MCU (15 pins), MEMS&RF (19 pins), Power (C4#2.2 U3.5)
VCC_5V: MCU (P1.1 P8.1), Power (J2.1)
GDO0: MCU (GDO0.1 U1.13), MEMS&RF (U5.6)
GDO2: MCU (GDO2.1 U1.14), MEMS&RF (U5.3)
INT1: MCU (INT1.1 U1.18), MEMS&RF (U4.11)
INT2: MCU (INT2.1 U1.19), MEMS&RF (U4.9)
SPI1_CS: MCU (CS1.1 U1.12), MEMS&RF (U5.7)
SPI1_MISO: MCU (MISO1.1 U1.16), MEMS&RF (U5.2)
SPI1_MOSI: MCU (MOSI1.1 U1.17), MEMS&RF (U5.20)
SPI1_SCLK: MCU (SCLK1.1 U1.15), MEMS&RF (U5.1)
SPI2_CS: MCU (CS2.1 U1.25), MEMS&RF (U4.8)
SPI2_MISO: MCU (MISO2.1 U1.27), MEMS&RF (U4.7)
SPI2_MOSI: MCU (MOSI2.1 U1.28), MEMS&RF (U4.6)
SPI2_SCLK: MCU (SCLK2.1 U1.26), MEMS&RF (U4.4)
SWCLK: MCU (P2#1.3 U1.37), Power (P2#2.3)
SWDIO: MCU (P2#1.2 U1.34), Power (P2#2.2)